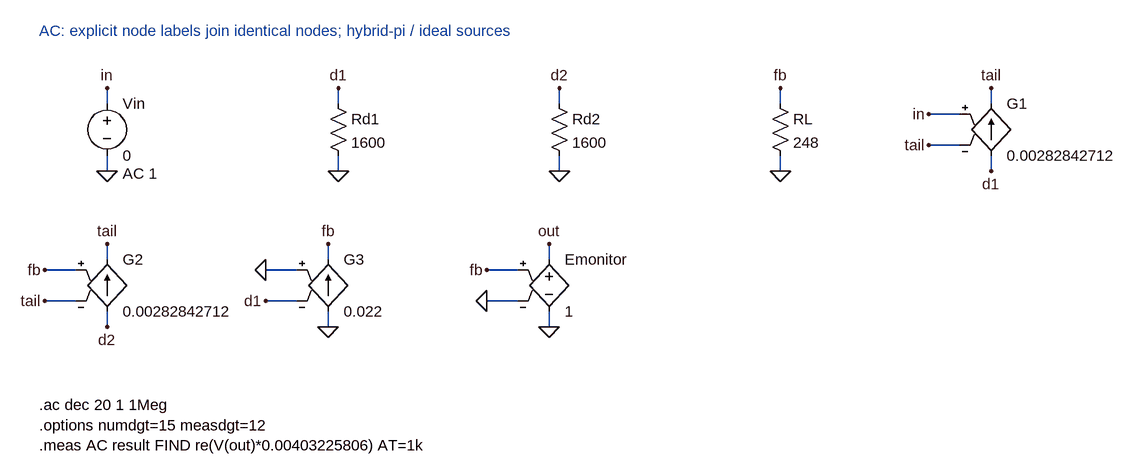
[diagram p0: schematic AC.asc]
AC.asc, the LTspice schematic file:
Version 4
SHEET 1 1800 1500
TEXT 16 -48 Left 2 ;AC: explicit node labels join identical nodes; hybrid-pi / ideal sources
WIRE 120 64 120 40
FLAG 120 40 in
WIRE 120 144 120 168
FLAG 120 168 0
SYMBOL voltage 120 48 R0
SYMATTR InstName Vin
WINDOW 123 24 124 Left 2
SYMATTR Value 0
SYMATTR Value2 AC 1
WIRE 476 64 476 40
FLAG 476 40 d1
WIRE 476 144 476 168
FLAG 476 168 0
SYMBOL res 460 48 R0
SYMATTR InstName Rd1
SYMATTR Value 1600
WIRE 816 64 816 40
FLAG 816 40 d2
WIRE 816 144 816 168
FLAG 816 168 0
SYMBOL res 800 48 R0
SYMATTR InstName Rd2
SYMATTR Value 1600
WIRE 1156 64 1156 40
FLAG 1156 40 fb
WIRE 1156 144 1156 168
FLAG 1156 168 0
SYMBOL res 1140 48 R0
SYMATTR InstName RL
SYMATTR Value 248
WIRE 1480 144 1480 168
FLAG 1480 168 d1
WIRE 1480 64 1480 40
FLAG 1480 40 tail
WIRE 1432 80 1384 80
FLAG 1384 80 in
WIRE 1432 128 1384 128
FLAG 1384 128 tail
SYMBOL g 1480 48 R0
SYMATTR InstName G1
SYMATTR Value 0.00282842712
WIRE 120 384 120 408
FLAG 120 408 d2
WIRE 120 304 120 280
FLAG 120 280 tail
WIRE 72 320 24 320
FLAG 24 320 fb
WIRE 72 368 24 368
FLAG 24 368 tail
SYMBOL g 120 288 R0
SYMATTR InstName G2
SYMATTR Value 0.00282842712
WIRE 460 384 460 408
FLAG 460 408 0
WIRE 460 304 460 280
FLAG 460 280 fb
WIRE 412 320 364 320
FLAG 364 320 0
WIRE 412 368 364 368
FLAG 364 368 d1
SYMBOL g 460 288 R0
SYMATTR InstName G3
SYMATTR Value 0.022
WIRE 800 304 800 280
FLAG 800 280 out
WIRE 800 384 800 408
FLAG 800 408 0
WIRE 752 320 704 320
FLAG 704 320 fb
WIRE 752 368 704 368
FLAG 704 368 0
SYMBOL e 800 288 R0
SYMATTR InstName Emonitor
SYMATTR Value 1
TEXT 16 528 Left 2 !.ac dec 20 1 1Meg\n.options numdgt=15 measdgt=12\n.meas AC result FIND re(V(out)*0.00403225806) AT=1k

The netlist it stands for:
* AC.asc
Vin in 0 0 AC 1
Rd1 d1 0 1600
Rd2 d2 0 1600
RL fb 0 248
G1 d1 tail in tail 0.00282842712
G2 d2 tail fb tail 0.00282842712
G3 0 fb 0 d1 0.022
Emonitor out 0 fb 0 1
* AC: explicit node labels join identical nodes; hybrid-pi / ideal sources
.ac dec 20 1 1Meg
.options numdgt=15 measdgt=12
.meas AC result FIND re(V(out)*0.00403225806) AT=1k
.backanno
.end

* Results of the author's LTspice run, read from the files saved beside the schematic
* From the log:
*   result: re(V(out)*0.00403225806)=(-48.5655559571dB,0°) at 1000